# Altium schematic sheet SML-230109PCB1__BLE.SchDoc
size A4; DocumentNumber: 6; SheetNumber: 6; SheetTotal: 6
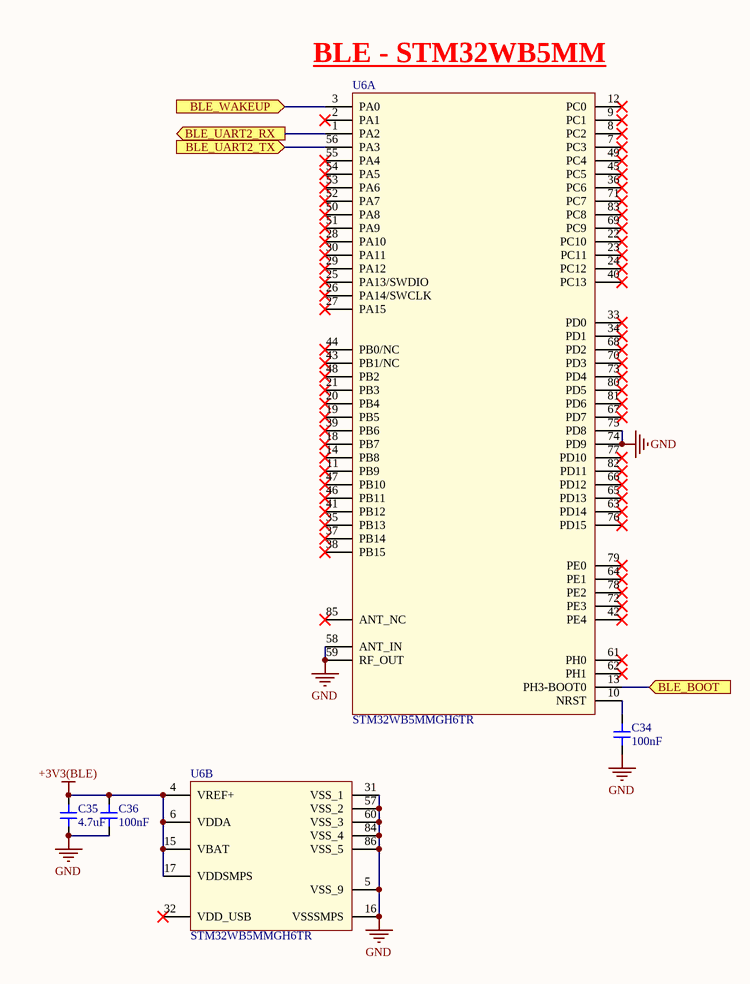
[diagram p0: SML-230109PCB1__BLE.SchDoc]

## Parts
C34  value 100nF  [[G] CAP-MLCC__0603]  (hidden comment: .)
C35  value 4.7uF  [[G] CAP-MLCC__0603]  (hidden comment: .)
C36  value 100nF  [[G] CAP-MLCC__0603]  (hidden comment: .)
U6  .  [MCU/BLE__STM32WB5MMG__SIP-LGA-86]  (value not drawn)  (parts A,B of 2)

## Ports
BLE_BOOT (in, see 3[1B]), BLE_UART2_RX (out, see 3[1B]), BLE_UART2_TX (in, see 3[1B]), BLE_WAKEUP (in, see 3[1B])

## Nets
+3V3(BLE): C35.2 C36.2 U6.4(VREF+) U6.6(VDDA) U6.15(VBAT) U6.17(VDDSMPS)
GND: C34.1 C35.1 C36.1 U6.5(VSS_9) U6.16(VSSSMPS) U6.31(VSS_1) U6.57(VSS_2) U6.58(ANT_IN) U6.59(RF_OUT) U6.60(VSS_3) U6.74(PD9) U6.75(PD8) U6.84(VSS_4) U6.86(VSS_5)
BLE_BOOT: U6.13(PH3-BOOT0) ; port BLE_BOOT
BLE_UART2_RX: U6.1(PA2) ; port BLE_UART2_RX
BLE_UART2_TX: U6.56(PA3) ; port BLE_UART2_TX
BLE_WAKEUP: U6.3(PA0) ; port BLE_WAKEUP
NetC34_2: C34.2 U6.10(NRST)

Not connected (* = marked no-connect by the designer): U6 2(PA1)* 7(PC3)* 8(PC2)* 9(PC1)* 11(PB9)* 12(PC0)* 14(PB8)* 18(PB7)* 19(PB5)* 20(PB4)* 21(PB3)* 22(PC10)* 23(PC11)* 24(PC12)* 25(PA13/SWDIO)* 26(PA14/SWCLK)* 27(PA15)* 28(PA10)* 29(PA12)* 30(PA11)* 32(VDD_USB)* 33(PD0)* 34(PD1)* 35(PB13)* 36(PC6)* 37(PB14)* 38(PB15)* 39(PB6)* 40(PC13)* 41(PB12)* 42(PE4)* 43(PB1/NC)* 44(PB0/NC)* 45(PC5)* 46(PB11)* 47(PB10)* 48(PB2)* 49(PC4)* 50(PA8)* 51(PA9)* 52(PA7)* 53(PA6)* 54(PA5)* 55(PA4)* 61(PH0)* 62(PH1)* 63(PD14)* 64(PE1)* 65(PD13)* 66(PD12)* 67(PD7)* 68(PD2)* 69(PC9)* 70(PD3)* 71(PC7)* 72(PE3)* 73(PD4)* 76(PD15)* 77(PD10)* 78(PE2)* 79(PE0)* 80(PD5)* 81(PD6)* 82(PD11)* 83(PC8)* 85(ANT_NC)*

## Notes on the sheet
- (near U6) BLE - STM32WB5MM
- Title
- Size:
- Date:
- A4
- Number:
- Revision:
- Sheet
- of
- SEMILLA3 OÜ
- Seebi tn 1-1501, Tallinn 11316. Estonia.
- Registry No.: 16636757
- VAT No. EE102568505
- File:

## Library data of the parts
C34 C36 = CAP_MLCC_0603: CAP MLCC 0603; [00] - Description (BOM): CAP MLCC 100nF 0603 010; [04] - Power features: 010; STAR Code: C100nF0603010; [06] - Package: 0603; [01] - MPN Code: *; [02] - Manufacturer: *; [03] - Datasheet: *; [05] - Temperature range: *; [07] - PVP Dealer name: *; [08] - PVP 1K: *; Voltage: 010
C35 = CAP_MLCC_0603: CAP MLCC 0603; [00] - Description (BOM): CAP MLCC 4.7uF 0603 010; [04] - Power features: 010; STAR Code: C4.7uF0603010; [06] - Package: 0603; [01] - MPN Code: *; [02] - Manufacturer: *; [03] - Datasheet: *; [05] - Temperature range: *; [07] - PVP Dealer name: *; [08] - PVP 1K: *; Voltage: 010
U6 = STM32WB5MMGH6TR: MCU/BLE ARM 32bit, M0+ & M4 (64MHz), 1MB/256KB, 6dBm, -96dBm, SIP-LGA-86; [02] - Manufacturer: STMicroelectronics; [04] - Power features: Vin=1'8-3'6V; [05] - Temperature range: -40 to +85 ºC; [00] - Description (BOM): MCU/BLE ARM 32bit, M0+ & M4 (64MHz), 1MB/256KB, 6dBm, -96dBm, SIP-LGA-86; [03] - Datasheet: https://www.st.com/resource/en/datasheet/stm32wb5mmg.pdf; [06] - Package: SIP-LGA-86; [07] - PVP Dealer name: *; [08] - PVP 1K: *; STAR Code: *; [01] - MPN Code: STM32WB5MMGH6TR